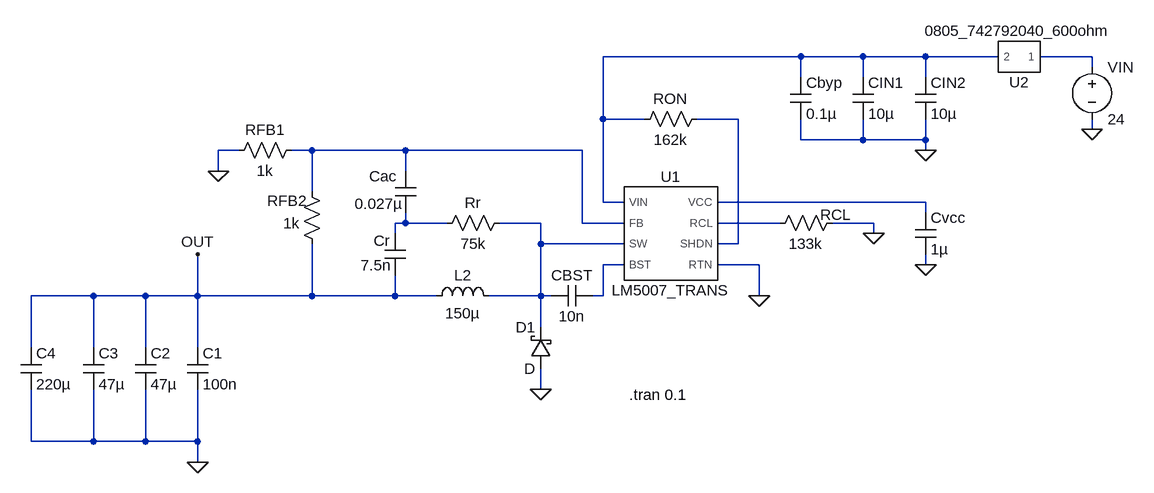
[diagram p0: schematic 24-V Input and 5-V Output Buck Converter.asc]
24-V Input and 5-V Output Buck Converter.asc, the LTspice schematic file:
Version 4
SHEET 1 880 680
WIRE 352 -112 48 -112
WIRE 448 -112 352 -112
WIRE 544 -112 448 -112
WIRE 656 -112 544 -112
WIRE 800 -112 720 -112
WIRE 800 -96 800 -112
WIRE 352 -80 352 -112
WIRE 448 -80 448 -112
WIRE 544 -80 544 -112
WIRE 48 -16 48 -112
WIRE 112 -16 48 -16
WIRE 256 -16 192 -16
WIRE 800 0 800 -16
WIRE 352 16 352 -16
WIRE 448 16 448 -16
WIRE 448 16 352 16
WIRE 544 16 544 -16
WIRE 544 16 448 16
WIRE -512 32 -544 32
WIRE -400 32 -432 32
WIRE -256 32 -400 32
WIRE 16 32 -256 32
WIRE 544 32 544 16
WIRE -544 64 -544 32
WIRE -256 64 -256 32
WIRE -400 96 -400 32
WIRE 48 112 48 -16
WIRE 80 112 48 112
WIRE 544 112 224 112
WIRE 544 128 544 112
WIRE -256 144 -256 128
WIRE -256 144 -272 144
WIRE -192 144 -256 144
WIRE -48 144 -112 144
WIRE 16 144 16 32
WIRE 80 144 16 144
WIRE 320 144 224 144
WIRE 464 144 400 144
WIRE -272 160 -272 144
WIRE 464 160 464 144
WIRE -48 176 -48 144
WIRE 80 176 -48 176
WIRE 256 176 256 -16
WIRE 256 176 224 176
WIRE 80 208 48 208
WIRE 288 208 224 208
WIRE 544 208 544 192
WIRE -736 256 -832 256
WIRE -656 256 -736 256
WIRE -576 256 -576 192
WIRE -576 256 -656 256
WIRE -400 256 -400 176
WIRE -400 256 -576 256
WIRE -272 256 -272 224
WIRE -272 256 -400 256
WIRE -208 256 -272 256
WIRE -48 256 -48 176
WIRE -48 256 -128 256
WIRE -32 256 -48 256
WIRE 48 256 48 208
WIRE 48 256 32 256
WIRE 288 256 288 208
WIRE -48 304 -48 256
WIRE -832 336 -832 256
WIRE -736 336 -736 256
WIRE -656 336 -656 256
WIRE -576 336 -576 256
WIRE -48 400 -48 368
WIRE -832 480 -832 400
WIRE -736 480 -736 400
WIRE -736 480 -832 480
WIRE -656 480 -656 400
WIRE -656 480 -736 480
WIRE -576 480 -576 400
WIRE -576 480 -656 480
WIRE -576 512 -576 480
FLAG 464 160 0
FLAG -544 64 0
FLAG 288 256 0
FLAG 544 208 0
FLAG 800 0 0
FLAG -48 400 0
FLAG -576 512 0
FLAG -576 192 OUT
FLAG 544 32 0
SYMBOL AutoGenerated\\LM5007_TRANS 144 160 R0
SYMATTR InstName U1
SYMBOL cap 528 128 R0
SYMATTR InstName Cvcc
SYMATTR Value 1µ
SYMATTR SpiceLine V=25
SYMBOL cap 32 240 R90
WINDOW 0 0 32 VBottom 2
WINDOW 3 32 32 VTop 2
SYMATTR InstName CBST
SYMATTR Value 10n
SYMBOL ind -224 272 R270
WINDOW 0 32 56 VTop 2
WINDOW 3 5 56 VBottom 2
SYMATTR InstName L2
SYMATTR Value 150µ
SYMBOL res 416 128 R90
WINDOW 0 19 10 VBottom 2
WINDOW 3 32 56 VTop 2
SYMATTR InstName RCL
SYMATTR Value 133k
SYMBOL res -416 16 R90
WINDOW 0 0 56 VBottom 2
WINDOW 3 32 56 VTop 2
SYMATTR InstName RFB1
SYMATTR Value 1k
SYMBOL res 96 0 R270
WINDOW 0 32 56 VTop 2
WINDOW 3 0 56 VBottom 2
SYMATTR InstName RON
SYMATTR Value 162k
SYMBOL res -416 80 R0
WINDOW 0 -53 30 Left 2
WINDOW 3 -28 64 Left 2
SYMATTR InstName RFB2
SYMATTR Value 1k
SYMBOL cap 336 -80 R0
SYMATTR InstName Cbyp
SYMATTR Value 0.1µ
SYMBOL cap 432 -80 R0
SYMATTR InstName CIN1
SYMATTR Value 10µ
SYMATTR SpiceLine V=35
SYMBOL voltage 800 -112 R0
WINDOW 123 0 0 Left 2
WINDOW 39 0 0 Left 2
SYMATTR InstName VIN
SYMATTR Value 24
SYMBOL schottky -32 368 R180
WINDOW 0 24 64 Left 2
WINDOW 3 24 0 Left 2
SYMATTR InstName D1
SYMBOL res -96 128 R90
WINDOW 0 0 56 VBottom 2
WINDOW 3 32 56 VTop 2
SYMATTR InstName Rr
SYMATTR Value 75k
SYMBOL cap -288 160 R0
WINDOW 0 -17 11 Left 2
WINDOW 3 -37 49 Left 2
SYMATTR InstName Cr
SYMATTR Value 7.5n
SYMBOL cap -272 64 R0
WINDOW 0 -40 8 Left 2
WINDOW 3 -62 50 Left 2
SYMATTR InstName Cac
SYMATTR Value 0.027µ
SYMATTR SpiceLine V=50
SYMBOL cap -592 336 R0
SYMATTR InstName C1
SYMATTR Value 100n
SYMBOL cap -672 336 R0
SYMATTR InstName C2
SYMATTR Value 47µ
SYMATTR SpiceLine V=10
SYMBOL cap -752 336 R0
SYMATTR InstName C3
SYMATTR Value 47µ
SYMATTR SpiceLine V=10
SYMBOL cap -848 336 R0
SYMATTR InstName C4
SYMATTR Value 220µ
SYMATTR SpiceLine V=35
SYMBOL cap 528 -80 R0
SYMATTR InstName CIN2
SYMATTR Value 10µ
SYMATTR SpiceLine V=35
SYMBOL AutoGenerated\\0805_742792040_600ohm 688 -112 R180
SYMATTR InstName U2
TEXT 88 408 Left 2 !.tran 0.1

The netlist it stands for:
* 24-V Input and 5-V Output Buck Converter.asc
XU1 N001 N004 N007 N009 N005 N008 N003 0 LM5007_TRANS  ; pins VIN FB SW BST VCC RCL SHDN RTN
Cvcc N005 0 1µ V=25
CBST N009 N007 10n
L2 OUT N007 150µ
RCL 0 N008 133k
RFB1 N004 0 1k
RON N001 N003 162k
RFB2 N004 OUT 1k
Cbyp N001 0 0.1µ
CIN1 N001 0 10µ V=35
VIN N002 0 24
D1 0 N007 D
Rr N007 N006 75k
Cr N006 OUT 7.5n
Cac N004 N006 0.027µ V=50
C1 OUT 0 100n
C2 OUT 0 47µ V=10
C3 OUT 0 47µ V=10
C4 OUT 0 220µ V=35
CIN2 N001 0 10µ V=35
XU2 N002 N001 0805_742792040_600ohm  ; pins 1 2
.model D D
.lib standard.dio
.tran 0.1
.lib lm5007_trans.lib
.lib C:\Users\simon\Downloads\742792040_LTSpice_WE-CBF_rev19a\WE-CBF_rev19a\WE-CBF.lib
.backanno
.end